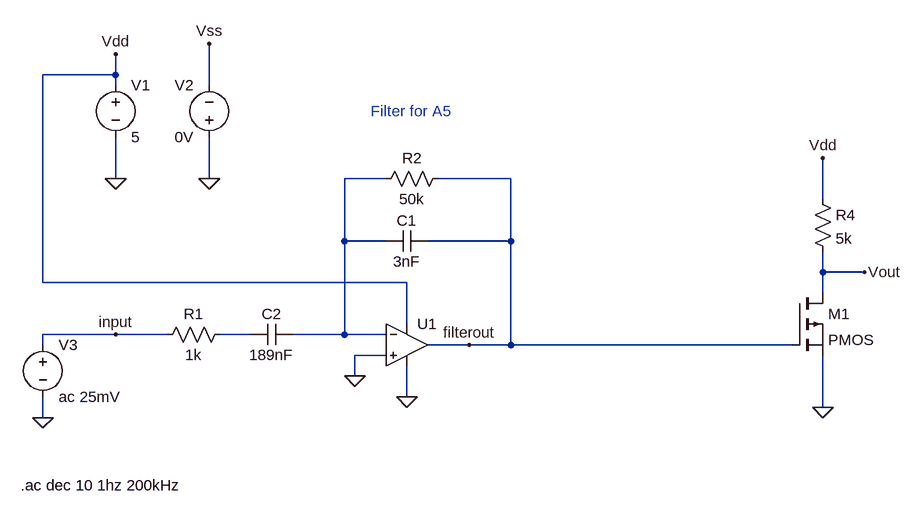
[diagram p0: schematic Backup_spice.asc]
Backup_spice.asc, the LTspice schematic file:
Version 4
SHEET 1 936 680
WIRE -288 -272 -288 -304
WIRE -288 -272 -400 -272
WIRE -288 -256 -288 -272
WIRE -144 -256 -144 -320
WIRE -288 -112 -288 -176
WIRE -144 -112 -144 -176
WIRE 128 -112 64 -112
WIRE 320 -112 208 -112
WIRE 800 -80 800 -144
WIRE 64 -16 64 -112
WIRE 128 -16 64 -16
WIRE 320 -16 320 -112
WIRE 320 -16 192 -16
WIRE 800 32 800 0
WIRE 864 32 800 32
WIRE -400 48 -400 -272
WIRE 160 48 -400 48
WIRE 800 64 800 32
WIRE 160 112 160 48
WIRE -288 128 -400 128
WIRE -208 128 -288 128
WIRE -80 128 -128 128
WIRE 64 128 64 -16
WIRE 64 128 -16 128
WIRE 128 128 64 128
WIRE -400 144 -400 128
WIRE 256 144 192 144
WIRE 320 144 320 -16
WIRE 320 144 256 144
WIRE 752 144 320 144
WIRE 128 160 80 160
WIRE 80 192 80 160
WIRE 160 224 160 176
WIRE 800 240 800 160
WIRE -400 256 -400 224
FLAG 80 192 0
FLAG -288 -304 Vdd
FLAG -144 -320 Vss
FLAG -144 -112 0
FLAG -288 -112 0
FLAG 160 224 0
FLAG -400 256 0
FLAG 800 -144 Vdd
FLAG 800 240 0
FLAG 864 32 Vout
FLAG -288 128 input
FLAG 256 144 filterout
SYMBOL cap 192 -32 R90
WINDOW 0 0 32 VBottom 2
WINDOW 3 32 32 VTop 2
SYMATTR InstName C1
SYMATTR Value 3nF
SYMBOL cap -16 112 R90
WINDOW 0 0 32 VBottom 2
WINDOW 3 32 32 VTop 2
SYMATTR InstName C2
SYMATTR Value 189nF
SYMBOL res -112 112 R90
WINDOW 0 0 56 VBottom 2
WINDOW 3 32 56 VTop 2
SYMATTR InstName R1
SYMATTR Value 1k
SYMBOL res 224 -128 R90
WINDOW 0 0 56 VBottom 2
WINDOW 3 32 56 VTop 2
SYMATTR InstName R2
SYMATTR Value 50k
SYMBOL res 784 -96 R0
SYMATTR InstName R4
SYMATTR Value 5k
SYMBOL voltage -288 -272 R0
SYMATTR InstName V1
SYMATTR Value 5
SYMBOL voltage -144 -160 R180
WINDOW 0 24 96 Left 2
WINDOW 3 24 16 Left 2
SYMATTR InstName V2
SYMATTR Value 0V
SYMBOL Opamps\\UniversalOpamp2 160 144 R0
SYMATTR InstName U1
SYMBOL pmos 752 64 R0
SYMATTR InstName M1
SYMBOL voltage -400 128 R0
SYMATTR InstName V3
SYMATTR Value ac 25mV
TEXT 104 -216 Left 2 ;Filter for A5
TEXT -434 360 Left 2 !.ac dec 10 1hz 200kHz

The netlist it stands for:
* Backup_spice.asc
C1 filterout N001 3nF
C2 N001 N002 189nF
R1 N002 input 1k
R2 filterout N001 50k
R4 Vdd Vout 5k
V1 Vdd 0 5
V2 0 Vss 0V
XU1 0 N001 Vdd 0 filterout level.2 Avol=1Meg GBW=10Meg Slew=10Meg ilimit=25m rail=0 Vos=0 phimargin=45 en=0 enk=0 in=0 ink=0 Rin=500Meg  ; pins IN+ IN- V+ V- OUT
M1 Vout filterout 0 0 PMOS
V3 input 0 ac 25mV
.model NMOS NMOS
.model PMOS PMOS
.lib standard.mos
* Filter for A5
.ac dec 10 1hz 200kHz
.lib UniversalOpamps2.sub
.backanno
.end

* Results of the author's LTspice run, read from the files saved beside the schematic
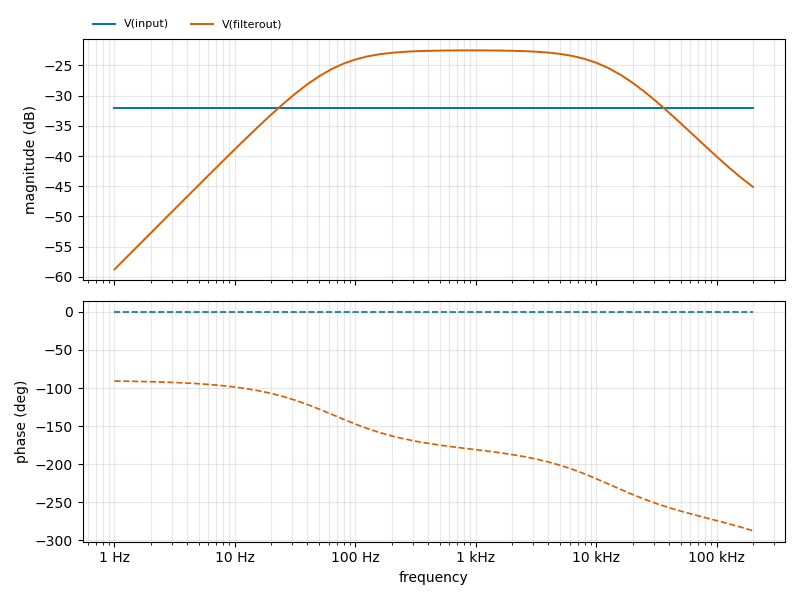
[diagram p1: AC Analysis of Backup_spice.asc, plotted from the saved traces]
* AC Analysis, 1 run:
*   V(input): -32.04 dB at 1 Hz, -32.04 dB at 200 kHz, peak -32.04 dB at 1 Hz
*   V(filterout): -58.76 dB at 1 Hz, -45.12 dB at 200 kHz, peak -22.51 dB at 1 kHz, 3 dB below the peak at 64.83 Hz and 12.82 kHz